# Altium schematic sheet super.SchDoc
size A3
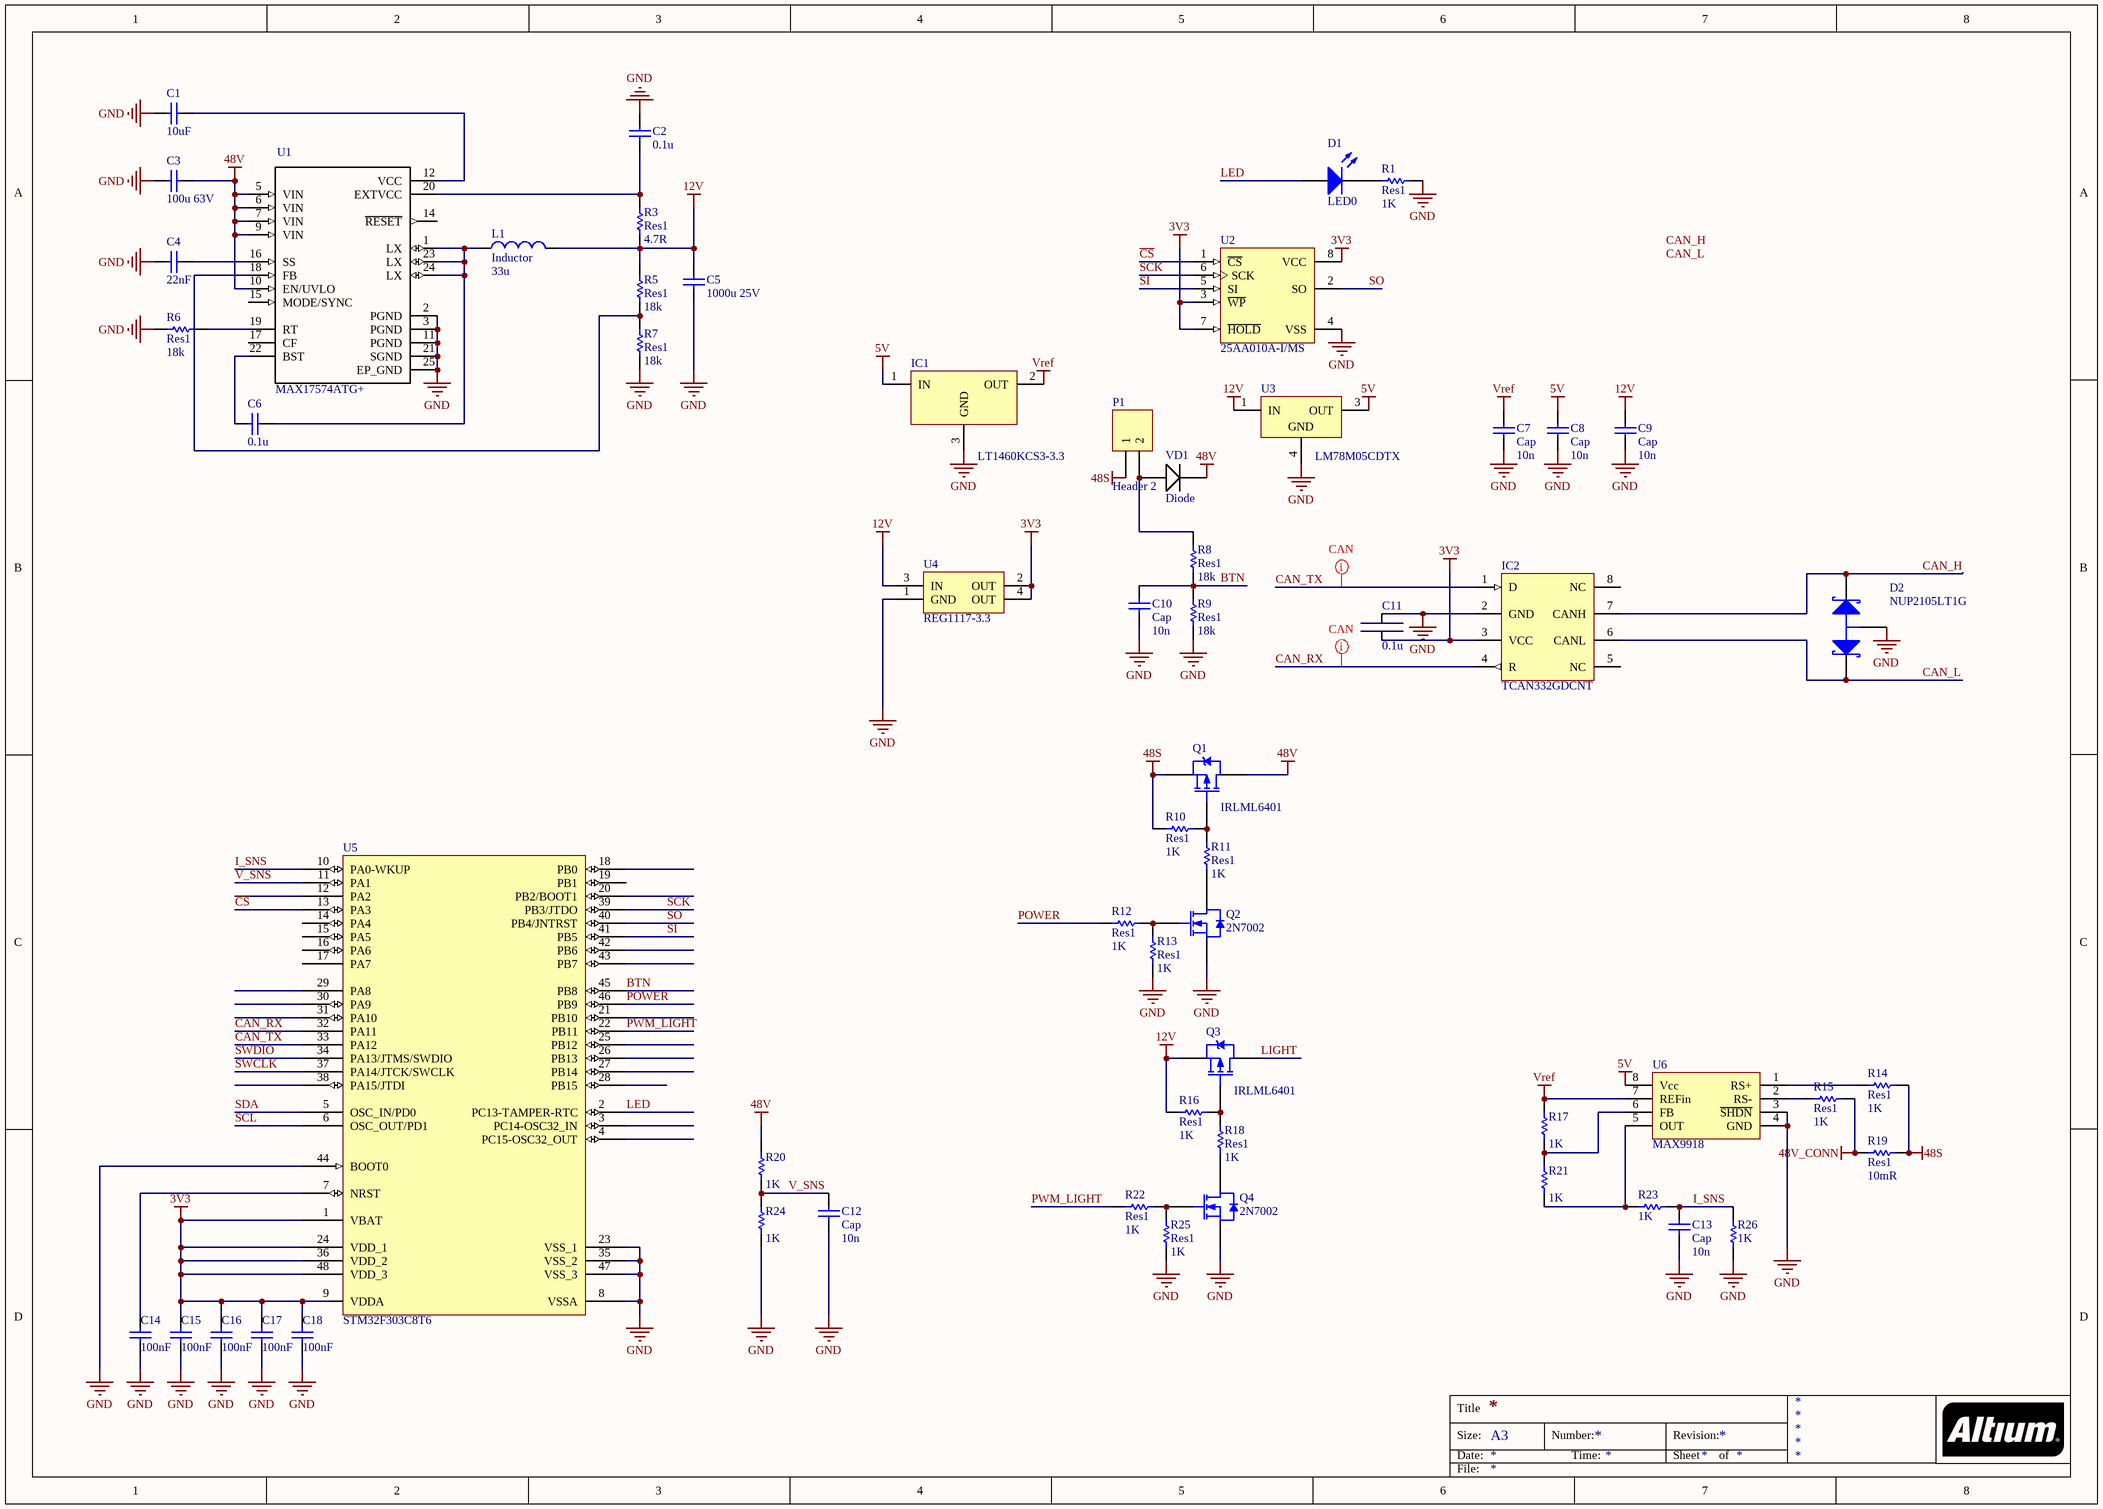
[diagram p0: super.SchDoc]

## Parts
C1  10uF  [1206x]
C2  0.1u  [0603x]
C3  100u 63V  [CAP_ELEC_10mm]
C4  22nF  [0603x]
C5  1000u 25V  [CAP_ELEC_10mm]
C6  0.1u  [0603x]
C7  Cap  value 10n  [0603x]
C8  Cap  value 10n  [0603x]
C9  Cap  value 10n  [0603x]
C10  Cap  value 10n  [0603x]
C11  0.1u  [CAPC1608X08N(0603)]
C12  Cap  value 10n  [0603x]
C13  Cap  value 10n  [0603x]
C14  value 100nF  [0603x]  (hidden comment: Cap)
C15  value 100nF  [0603x]  (hidden comment: Cap)
C16  value 100nF  [0603x]  (hidden comment: Cap)
C17  value 100nF  [0603x]  (hidden comment: Cap)
C18  value 100nF  [0603x]  (hidden comment: Cap)
D1  LED0  [HDR1X2]
D2  NUP2105LT1G  [SOT-23_M]
IC1  LT1460KCS3-3.3  [SOT23_N]
IC2  TCAN332GDCNT  [SOT23-8_L]
L1  Inductor  value 33u  [DR74]
P1  Header 2  [HDR1X2]
Q1  IRLML6401  [Micro3_N]
Q2  2N7002  [SOT23_N]
Q3  IRLML6401  [Micro3_N]
Q4  2N7002  [SOT23_N]
R1  Res1  value 1K  [0603x]
R3  Res1  value 4.7R  [0603x]
R5  Res1  value 18k  [0603x]
R6  Res1  value 18k  [0603x]
R7  Res1  value 18k  [0603x]
R8  Res1  value 18k  [0603x]
R9  Res1  value 18k  [0603x]
R10  Res1  value 1K  [0603x]
R11  Res1  value 1K  [0603x]
R12  Res1  value 1K  [1206x]
R13  Res1  value 1K  [0603x]
R14  Res1  value 1K  [0603x]
R15  Res1  value 1K  [0603x]
R16  Res1  value 1K  [0603x]
R17  value 1K  [0603x]  (hidden comment: Res1)
R18  Res1  value 1K  [0603x]
R19  Res1  value 10mR  [2512]
R20  value 1K  [0603x]  (hidden comment: Res1)
R21  value 1K  [0603x]  (hidden comment: Res1)
R22  Res1  value 1K  [0603x]
R23  value 1K  [1206x]  (hidden comment: Res1)
R24  value 1K  [0603x]  (hidden comment: Res1)
R25  Res1  value 1K  [0603x]
R26  value 1K  [0603x]  (hidden comment: Res1)
U1  MAX17574ATG+  [QFN50P500X400X80-25N]
U2  25AA010A-I/MS  [SO-8_N]
U3  LM78M05CDTX  [TO-252AA_L]
U4  REG1117-3.3  [SOt-223_L]
U5  STM32F303C8T6  [LQFP48_N]
U6  MAX9918  [SO8_M]
VD1  Diode  [SOD-80/MLL34]

## Nets
3V3: C11.2 C15.2 C16.2 C17.2 C18.2 IC2.3(VCC) U2.3(~{WP}) U2.7(~{HOLD}) U2.8(VCC) U4.2(OUT) U4.4(OUT) U5.1(VBAT) U5.9(VDDA) U5.24(VDD_1) U5.36(VDD_2) U5.48(VDD_3)
5V: C8.1 IC1.1(IN) U3.3(OUT) U6.8(Vcc)
12V: C5.1 C9.1 L1.2 Q3.2(S) R3.2 R5.2 R16.1 U3.1(IN) U4.3(IN)
48S: P1.1 Q1.2(S) R10.1 R14.2 R19.2
48V: C3.1 Q1.3(D) R20.1 U1.5(VIN) U1.6(VIN) U1.7(VIN) U1.9(VIN) U1.10(EN/UVLO) VD1.2(K)
48V_CONN: R15.2 R19.1
GND: C1.2 C2.2 C3.2 C4.1 C5.2 C7.2 C8.2 C9.2 C10.2 C11.1 C12.2 C13.2 C14.1 C15.1 C16.1 C17.1 C18.1 D2.3(A) IC1.3(GND) IC2.2(GND) Q2.2(S) Q4.2(S) R1.2 R6.2 R7.1 R9.1 R13.1 R24.2 R25.1 R26.1 U1.2(PGND) U1.3(PGND) U1.11(PGND) U1.21(SGND) U1.25(EP_GND) U2.4(VSS) U3.4(GND) U4.1(GND) U5.8(VSSA) U5.23(VSS_1) U5.35(VSS_2) U5.44(BOOT0) U5.47(VSS_3) U6.3(~{SHDN}) U6.4(GND)
Vref: C7.1 IC1.2(OUT) R17.1 U6.7(REFin)
BTN: C10.1 R8.1 R9.2 U5.45(PB8)
~{CS}: U2.1(~{CS}) U5.13(PA3)
CAN_H: D2.2(K2) IC2.7(CANH)
CAN_L: D2.1(K1) IC2.6(CANL)
CAN_RX: IC2.4(R) U5.32(PA11)
CAN_TX: IC2.1(D) U5.33(PA12)
I_SNS: C13.1 R23.2 R26.2 U5.10(PA0-WKUP)
LED: D1.1(A) U5.2(PC13-TAMPER-RTC)
LIGHT: Q3.3(D)
POWER: R12.1 U5.46(PB9)
PWM_LIGHT: R22.1 U5.22(PB11)
SCK: U2.6(SCK) U5.39(PB3/JTDO)
SCL: U5.6(OSC_OUT/PD1)
SDA: U5.5(OSC_IN/PD0)
SI: U2.5(SI) U5.41(PB5)
SO: U2.2(SO) U5.40(PB4/JNTRST)
SWCLK: U5.37(PA14/JTCK/SWCLK)
SWDIO: U5.34(PA13/JTMS/SWDIO)
V_SNS: C12.1 R20.2 R24.1 U5.11(PA1)
NetC1_1: C1.1 U1.12(VCC)
NetC2_1: C2.1 R3.1 U1.20(EXTVCC)
NetC4_2: C4.2 U1.16(SS)
NetC6_1: C6.1 U1.22(BST)
NetC6_2: C6.2 L1.1 U1.1(LX) U1.23(LX) U1.24(LX)
NetC14_2: C14.2 U5.7(NRST)
NetD1_2: D1.2(K) R1.1
NetP1_2: P1.2 R8.2 VD1.1(A)
NetQ1_1: Q1.1(G) R10.2 R11.1
NetQ2_1: Q2.1(G) R12.2 R13.2
NetQ2_3: Q2.3(D) R11.2
NetQ3_1: Q3.1(G) R16.2 R18.1
NetQ4_1: Q4.1(G) R22.2 R25.2
NetQ4_3: Q4.3(D) R18.2
NetR5_1: R5.1 R7.2 U1.18(FB)
NetR6_1: R6.1 U1.19(RT)
NetR14_1: R14.1 U6.1(RS+)
NetR15_1: R15.1 U6.2(RS-)
NetR17_2: R17.2 R21.1 U6.6(FB)
NetR21_2: R21.2 R23.1 U6.5(OUT)

Not connected (* = marked no-connect by the designer): IC2 5(NC) 8(NC); U1 14(~{RESET}) 15(MODE/SYNC) 17(CF); U5 3(PC14-OSC32_IN) 4(PC15-OSC32_OUT) 12(PA2) 14(PA4) 15(PA5) 16(PA6) 17(PA7) 18(PB0) 19(PB1) 20(PB2/BOOT1) 21(PB10) 25(PB12) 26(PB13) 27(PB14) 28(PB15) 29(PA8) 30(PA9) 31(PA10) 38(PA15/JTDI) 42(PB6) 43(PB7)

## Layout directives
net class CAN: CAN_RX, CAN_TX

## Notes on the sheet
- Labels drawn without touching a wire or pin: CAN_H, CAN_L
- Title
- Size:
- Date:
- A3
- Number:
- Time:
- Revision:
- Sheet
- of
- File:

## Library data of the parts
C1-C6 = Cap: Capacitor; Value: 100pF; Published: 8-Jun-2000; LatestRevisionDate: 17-Jul-2002; LatestRevisionNote: Re-released for DXP Platform.; PackageReference: RAD-0.3; Publisher: Altium Limited; PackageDescription: Radial Cap, Thru-Hole; 2 Leads; 0.3 in Pin Spacing
C7-C10 C12-C18 = Cap: Capacitor; Published: 8-Jun-2000; LatestRevisionDate: 17-Jul-2002; LatestRevisionNote: Re-released for DXP Platform.; PackageReference: RAD-0.3; Publisher: Altium Limited; PackageDescription: Radial Cap, Thru-Hole; 2 Leads; 0.3 in Pin Spacing
C11 = Ceramic Chip Capacitor: Value: CAP CER 0.1UF 50V X7R 0603; Order Number: 06035C104KAT2A; Distributor: AVX Corporation; Package: 0603
D1 = LED0: Typical INFRARED GaAs LED; Published: 8-Jun-2000; LatestRevisionDate: 08-Jul-2005; LatestRevisionNote: Mech Layer 1 removed.; PackageReference: LED-0; Publisher: Altium Limited; PackageDescription: LED; 2 Leads
D2 = BAT54A: Schottky Barrier Double Diode; LatestRevisionNote: IPC-7351 Footprint Added.; Package: SOT23; PackageDescription: 3-Pin SOT-23 Package 0.95 mm Pitch, 2.3 mm Lead Span; ComponentLink1Description: Manufacturer Link; ComponentLink1URL: http://www.semiconductors.philips.com/; Value: NUP2105LT1G; Distributor: ON Semiconductor; Order Number: NUP2105LT1G
IC1 = PreciseRef: Value: Voltage reference 3.3V 0.5% 50ppm/C; Order Number: LT1460KCS3-3.3#TRMPBF; Distrubutor: Linear Technology; Package: SOT23
L1 = Inductor: Code_IEC: 1005; Published: 8-Jun-2000; LatestRevisionDate: 29-May-2009; LatestRevisionNote: IPC-7351 Footprint Added.; PackageReference: 0402-A; Publisher: Altium Limited; PackageDescription: Chip Inductor; Code_JEITA: 0402
P1 = Header 2: Header, 2-Pin; LatestRevisionDate: 17-Jul-2002; LatestRevisionNote: Re-released for DXP Platform.; Publisher: Altium Limited
Q1 Q3 = IRLML6401: HEXFET Power MOSFET; Published: 17-Sep-2003; DatasheetVersion: 2-Jul-2001; PackageVersion: Jul-2001; PackageReference: Micro3; Publisher: Altium Limited; PackageDescription: 3-Pin SOT-23 Package 0.95 mm Pitch, 2.3 mm Lead Span; ComponentLink1Description: Manufacturer Link; ComponentLink1URL: http://www.irf.com/; ComponentLink2Description: Datasheet; ComponentLink2URL: http://www.irf.com/product-info/datasheets/data/IRLML6401.pdf
Q2 Q4 = 2N7002: N-channel Enhancement Mode Field-effect Transistor; Published: 17-Sep-2003; LatestRevisionDate: 12-Dec-2006; LatestRevisionNote: IPC-7351 Footprint Added.; DatasheetVersion: 27-Jul-2000; PackageVersion: May-1999; PackageReference: SOT23; Publisher: Altium Limited; PackageDescription: 3-Pin SOT-23 Package 0.95 mm Pitch, 2.3 mm Lead Span; ComponentLink1Description: Manufacturer Link; ComponentLink1URL: http://www.semiconductors.philips.com/; ComponentLink2Description: Datasheet; ComponentLink2URL: http://www.semiconductors.philips.com/acrobat/datasheets/2N7002_4.pdf
R1 R3 R5-R26 = Res1: Resistor; Published: 8-Jun-2000; LatestRevisionDate: 17-Jul-2002; LatestRevisionNote: Re-released for DXP Platform.; PackageReference: AXIAL-0.3; Publisher: Altium Limited; PackageDescription: Axial Device, Thru-Hole; 2 Leads; 0.3 in Pin Spacing
U1 = MAX17574ATG+: IC REG BUCK ADJ 3A SYNC 24TQFN; MF: Maxim Integrated; MP: MAX17574ATG+; Package: TQFN-24 Maxim Integrated; Digi-Key_Part_Number: MAX17574ATG+-ND; Digi-Key_Purchase_URL: https://www.digikey.com/product-detail/en/maxim-integrated/MAX17574ATG-/MAX17574ATG--ND/6579157?WT.z_cid=ref_snapeda&utm_source=snapeda&utm_medium=aggregator&utm_campaign=buynow; Value: *
U2 = 25AA010A-I/MS: 1K SPI Bus Serial EEPROM, 8-Pin MSOP, Industrial Temperature; Published: 29-Jan-2009; LatestRevisionDate: 02-Dec-2009; LatestRevisionNote: Updated to datasheet revision E, Jan-2008; DatasheetVersion: revE, Sep-2008; PackageVersion: revBB, Aug-2009; PackageReference: MSOP-MS8; Publisher: Altium Limited; PackageDescription: 8-Lead Plastic Micro Small Outline Package (MS) [MSOP]; Supplier 1: Digi-Key; Supplier Part Number 1: 25AA010A-I/MS-ND; Supplier 2: Farnell; Supplier Part Number 2: 1331337; ComponentLink1Description: Datasheet; ComponentLink1URL: http://ww1.microchip.com/downloads/en/DeviceDoc/21832E.pdf; ComponentLink2Description: Packaging Specification; ComponentLink2URL: http://www.microchip.com/stellent/groups/techpub_sg/documents/packagingspec/en012702.pdf; ComponentLink3Description: Microchip.com Home; ComponentLink3URL: http://www.microchip.com/
U3 = LM78M05CDTX: 3-Terminal Positive Voltage Regulators, 3-pin TO-252; Manufacturer: National Semiconductor; PackageTopMarking: NSUZXYTT*LM78M05*CDT; PowerWise: N; CompType: LDO IC; Published: 1-Mar-2010; DatasheetVersion: Aug-2005; PackageVersion: revD, Feb-2009; PackageReference: TD03B; Publisher: Altium Limited; PackageDescription: TO252, Molded, Jedec, 6.8 x 6.10 x 2.30mm Body, 3 Lead, 2.28mm Pitch, Surface Mount; PartNumber: LM78M05CDTX; RoHS: N; PinCount: 3; Code_JEDEC: TO-252-AA; ComponentLink1Description: LM78M05 Datasheet; ComponentLink1URL: http://www.national.com/ds/LM/LM78M05.pdf; ComponentLink2Description: LM78M05 Web Page; ComponentLink2URL: http://www.national.com/pf/LM/LM78M05.html; ComponentLink3Description: TD03B Package Page; ComponentLink3URL: http://www.national.com/packaging/folders/td03b.html
U4 = REG1117-3.3: 800mA and 1A Low Dropout Positive Regulator 2.85V, 3.3V, 5V, and Adjustable; Published: 8-Jun-2000; LatestRevisionDate: 17-Jul-2002; LatestRevisionNote: Re-released for DXP Platform.; DatasheetVersion: Sep-1997; PackageVersion: revC; PackageReference: ZZ311; Publisher: Altium Limited; PackageDescription: SOT-223/SC-73; 4 Leads; Body 6.7 x 7.3 mm, inc. leads (LxW max); ComponentLink1Description: Manufacturer Link; ComponentLink1URL: http://www.ti.com/; ComponentLink2Description: Datasheet; ComponentLink2URL: http://www-s.ti.com/sc/ds/REG1117.pdf
U5 = STM32F103C6T6: STM32 ARM-based 32-bit MCU with 32 Kbytes Flash, 48-pin LQFP, Industrial Temperature; Published: 30-May-2008; DatasheetVersion: rev6, Mar-2008; PackageVersion: Mar-2008; PackageReference: LQFP48; Publisher: Altium Limited; PackageDescription: 48-Pin Low-Profile Quad Flat Pack, 7 x 7 mm Body, 0.5 mm Pitch (LQFP48); ComponentLink1Description: Manufacturer Link; ComponentLink1URL: www.st.com/stm32; ComponentLink2Description: Datasheet; ComponentLink2URL: http://www.st.com/stonline/products/literature/ds/13587.pdf
VD1 = Diode: Default Diode; Published: 8-Jun-2000; LatestRevisionDate: 17-Jul-2002; LatestRevisionNote: Re-released for DXP Platform.; PackageVersion: Sep-1996; PackageReference: SMC; Publisher: Altium Limited; PackageDescription: DO-214-AB/SMC; 2 C-Bend Leads; Body 7.9 x 5.9 mm, inc. leads (LxW); Code_JEDEC: DO-214-AB
IC2 = TCAN332GDCNT: Order Number: TCAN332GDCNT; Package: SOT23-8; Value: TCAN332GDCNT; Distributor: Texas Instruments